# EAGLE design M104D (EAGLE 6.6.0)
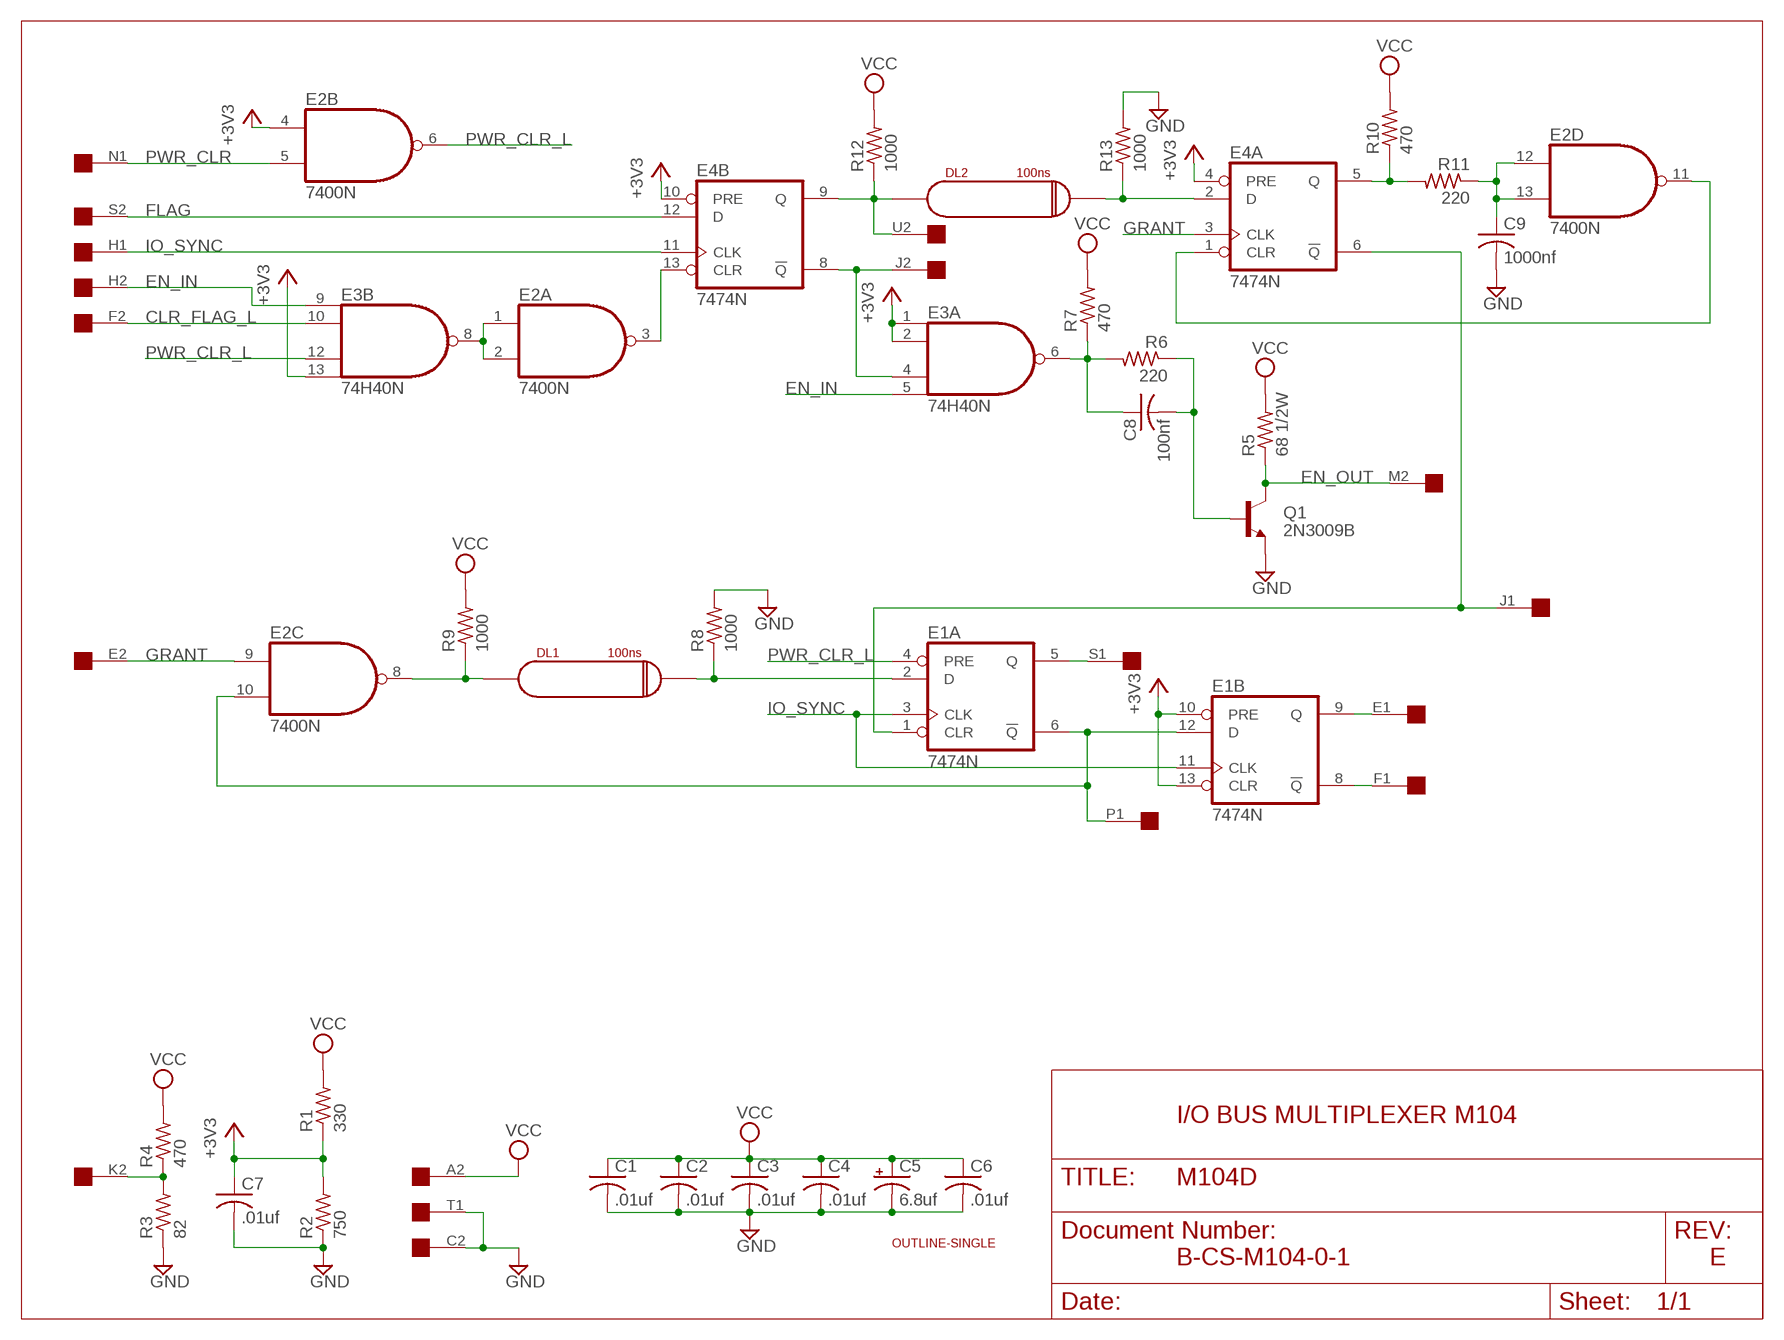
[diagram p0: schematic, sheet 1]

## Parts
C1  .01uf  C-US050-025X075  [C050-025X075]
C2  .01uf  C-US050-025X075  [C050-025X075]
C3  .01uf  C-US050-025X075  [C050-025X075]
C4  .01uf  C-US050-025X075  [C050-025X075]
C5  6.8uf  CPOL-USE15-5AXIAL  [E15-5]
C6  .01uf  C-US050-025X075  [C050-025X075]
C7  .01uf  C-US050-025X075  [C050-025X075]
C8  100nf  C-US050-025X075  [C050-025X075]
C9  1000nf  C-US050-025X075  [C050-025X075]
DL1  100ns  RC-L-22  [RCL-L-XX-22]
DL2  100ns  RC-L-22  [RCL-L-XX-22]
E1  7474N  74S74N  [DIL14]
E2  7400N  [DIL14]
E3  74H40N  74S20N  [DIL14]
E4  7474N  74S74N  [DIL14]
Q1  2N3009B  2N1613-NPN-TO39-EBC  [TO39]
R1  330  R-US_0207/10  [0207/10]
R2  750  R-US_0207/10  [0207/10]
R3  82  R-US_0207/10  [0207/10]
R4  470  R-US_0207/10  [0207/10]
R5  68 1/2W  R-US_0411/15  [0411/15]
R6  220  R-US_0207/10  [0207/10]
R7  470  R-US_0207/10  [0207/10]
R8  1000  R-US_0207/10  [0207/10]
R9  1000  R-US_0207/10  [0207/10]
R10  470  R-US_0207/10  [0207/10]
R11  220  R-US_0207/10  [0207/10]
R12  1000  R-US_0207/10  [0207/10]
R13  1000  R-US_0207/10  [0207/10]
U$8  SINGLE  [EDGE-CON2]
U$9  OUTLINE-SINGLE  [SINGLE]

## Nets
+3V3: C7.1 E1.10(B:PRE) E1.13(B:CLR) E2.4(B:I0) E3.1(A:I0) E3.2(A:I1) E3.13(B:I3) E4.4(A:PRE) E4.10(B:PRE) R1.1 R2.2
CLR_FLAG_L: E3.10(B:I1) U$8.F2
EN_IN: E3.5(A:I3) E3.9(B:I0) U$8.H2
EN_OUT: Q1.3(C) R5.1 U$8.M2
FLAG: E4.12(B:D) U$8.S2
GND [Supply]: C1.2 C2.2 C3.2 C4.2 C5.- C6.2 C7.2 C9.2 Q1.1(E) R2.1 R3.1 R8.2 R13.2 U$8.C2 U$8.T1
GRANT: E2.9(C:I0) E4.3(A:CLK) U$8.E2
IO_SYNC: E1.3(A:CLK) E1.11(B:CLK) E4.11(B:CLK) U$8.H1
K2: R3.2 R4.1 U$8.K2
N$1: E1.1(A:CLR) E4.6(A:!Q) U$8.J1
N$2: DL2.IN E4.9(B:Q) R12.1 U$8.U2
N$3: E3.4(A:I2) E4.8(B:!Q) U$8.J2
N$4: DL2.OUT E4.2(A:D) R13.1
N$5: C8.1 E3.6(A:O) R6.2 R7.1
N$6: E2.1(A:I0) E2.2(A:I1) E3.8(B:O)
N$7: E2.3(A:O) E4.13(B:CLR)
N$8: C9.1 E2.12(D:I0) E2.13(D:I1) R11.1
N$9: E2.11(D:O) E4.1(A:CLR)
N$10: DL1.IN E2.8(C:O) R9.1
N$11: DL1.OUT E1.2(A:D) R8.1
N$12: E1.6(A:!Q) E1.12(B:D) E2.10(C:I1) U$8.P1
N$13: E1.8(B:!Q) U$8.F1
N$14: E1.9(B:Q) U$8.E1
N$15: E1.5(A:Q) U$8.S1
N$16: E4.5(A:Q) R10.1 R11.2
N$17: C8.2 Q1.2(B) R6.1
PWR_CLR: E2.5(B:I1) U$8.N1
PWR_CLR_L: E1.4(A:PRE) E2.6(B:O) E3.12(B:I2)
VCC [Supply]: C1.1 C2.1 C3.1 C4.1 C5.+ C6.1 R1.2 R4.2 R5.2 R7.2 R9.2 R10.2 R12.2 U$8.A2
Unconnected: U$8.A1 U$8.B1 U$8.B2 U$8.C1 U$8.D1 U$8.D2 U$8.K1 U$8.L1 U$8.L2 U$8.M1 U$8.N2 U$8.P2 U$8.R1 U$8.R2 U$8.T2 U$8.U1 U$8.V1 U$8.V2

## Notes on the sheet
- I/O BUS MULTIPLEXER M104
- B-CS-M104-0-1 | E

## Power pins joined to a net without a drawn wire
GND: DL1.GND@1(GND) DL1.GND@2(GND) DL2.GND@1(GND) DL2.GND@2(GND) E1.7(P:GND) E2.7(P:GND) E3.7(P:GND) E4.7(P:GND)
VCC: E1.14(P:VCC) E2.14(P:VCC) E3.14(P:VCC) E4.14(P:VCC)

## Library data of the parts
C1-C4 C6-C9 = rcl:C-US: CAPACITOR, American symbol
C5 = rcl:CPOL-US: POLARIZED CAPACITOR, American symbol
DL1 DL2 = dec-con:RC-L-22: Delay Line
E1 E4 = 74xx-us:74*74: Dual D type positive edge triggered FLIP FLOP, preset and clear
E2 = 74xx-us:74*00: Quad 2-input NAND gate
E3 = 74xx-us:74*20: Dual 4-input NAND gate
Q1 = transistor:*-NPN-: NPN Transistror BF959 corrected 2008.03.06
R1-R13 = rcl:R-US_: RESISTOR, American symbol
U$8 = dec-con:SINGLE: Single-Height DEC board
U$9 = dec-con:OUTLINE-*: Board outlines for DEC boards.

## Net classes
1 Supply: width 0.813 mm

## Board
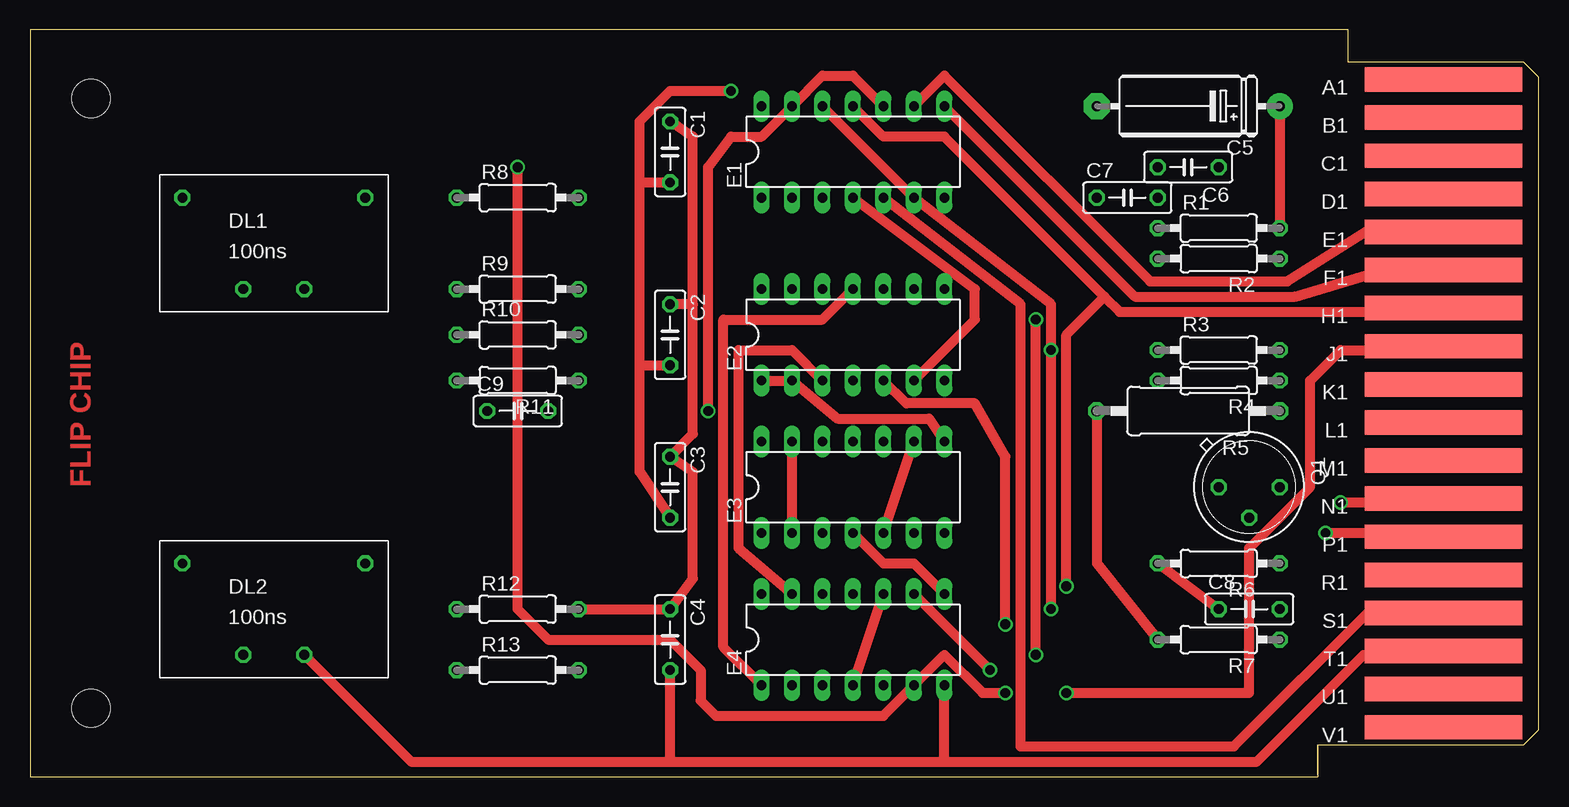
[diagram p1: board, top side]
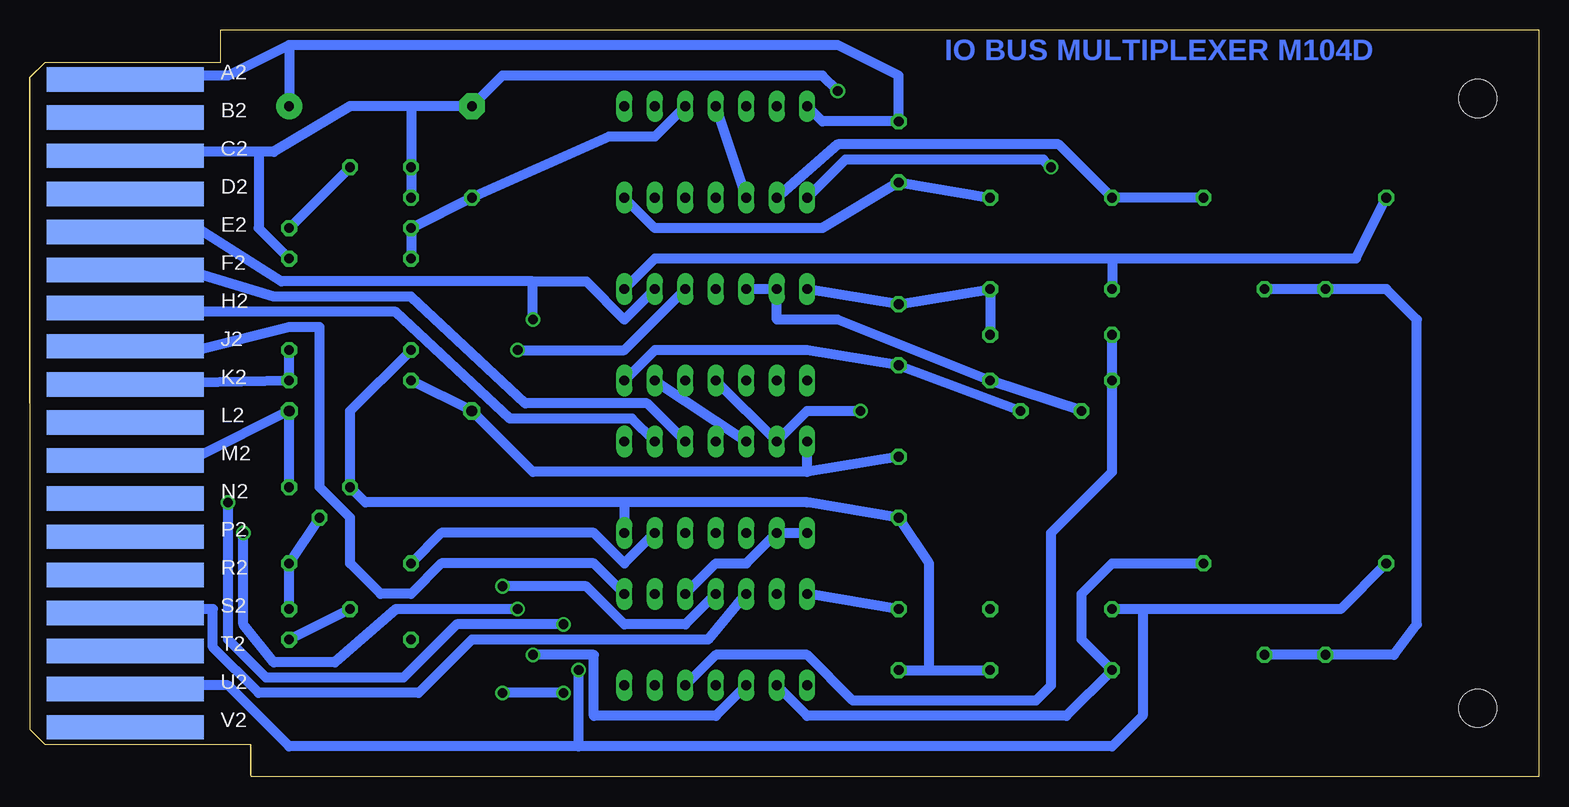
[diagram p2: board, bottom side, seen from below]

Size 125.73 x 62.23 mm. Coordinates in mm from the lower left corner, seen from the top.
Copper layers (1+16): Top 0.035mm / dielectric 1.5mm / Bottom 0.035mm
Design rules "16mils": minimum track width 16mil, minimum drill 32mil, track to track 15mil, track to pad 10mil, pad to pad 10mil, via to via 10mil, smd to smd 10mil, copper to edge 13mil, drill to drill 10mil, minimum pad ring 10mil, minimum via ring 8mil, stop-mask expansion 0mil, vias tented up to drill 0mil, thermal gap 10mil

### Footprints (pad centres in the part's own frame; a part is rotated, then mirrored left to right if it is on the bottom)
C050-025X075 = drill 0.813 octagon: 1 -2.54,0; 2 2.54,0
E15-5 = drill 0.813 pad 2.159: + -7.62,0 | drill 0.813 pad 2.159 octagon: - 7.62,0
RCL-L-XX-22 = drill 0.813 octagon: GND@1 6.35,1.27; GND@2 11.43,1.27; IN 1.27,8.89; OUT 16.51,8.89
DIL14 = drill 0.813 long: 1 -7.62,-3.81; 2 -5.08,-3.81; 3 -2.54,-3.81; 4 0,-3.81; 5 2.54,-3.81; 6 5.08,-3.81; 7 7.62,-3.81; 8 7.62,3.81; 9 5.08,3.81; 10 2.54,3.81; 11 0,3.81; 12 -2.54,3.81; 13 -5.08,3.81; 14 -7.62,3.81
TO39 = drill 0.813 octagon: 1 0,-2.54; 2 2.54,0; 3 0,2.54
0207/10 = drill 0.813 octagon: 1 -5.08,0; 2 5.08,0
0411/15 = drill 0.914 octagon: 1 -7.62,0; 2 7.62,0
EDGE-CON2 = smd 13.106 x 2.032: A1 7.938,4.128; B1 7.938,7.303; C1 7.938,10.477; D1 7.938,13.652; E1 7.938,16.828; F1 7.938,20.003; H1 7.938,23.177; J1 7.938,26.352; K1 7.938,29.527; L1 7.938,32.703; M1 7.938,35.877; N1 7.938,39.053; P1 7.938,42.227; R1 7.938,45.403; S1 7.938,48.578; T1 7.938,51.752; U1 7.938,54.928; V1 7.938,58.102 | smd 13.106 x 2.032 bottom: A2 7.938,4.128; B2 7.938,7.303; C2 7.938,10.477; D2 7.938,13.652; E2 7.938,16.828; F2 7.938,20.003; H2 7.938,23.177; J2 7.938,26.352; K2 7.938,29.527; L2 7.938,32.703; M2 7.938,35.877; N2 7.938,39.053; P2 7.938,42.227; R2 7.938,45.403; S2 7.938,48.578; T2 7.938,51.752; U2 7.938,54.928; V2 7.938,58.102
SINGLE = hole 3.175: 120.65,56.515; 120.65,5.715

### Placement (x,y rotation side)
C1  53.34,52.07 270 top
C2  53.34,36.83 270 top
C3  53.34,24.13 270 top
C4  53.34,11.43 270 top
C5  96.52,55.88 180 top
C6  96.52,50.8 180 top
C7  91.44,48.26 0 top
C8  101.6,13.97 0 top
C9  40.64,30.48 0 top
DL1  11.43,39.37 0 top
DL2  11.43,8.89 0 top
E1  68.58,52.07 0 top
E2  68.58,36.83 0 top
E3  68.58,24.13 0 top
E4  68.58,11.43 0 top
Q1  101.6,24.13 270 top
R1  99.06,45.72 0 top
R2  99.06,43.18 180 top
R3  99.06,35.56 0 top
R4  99.06,33.02 180 top
R5  96.52,30.48 180 top
R6  99.06,17.78 180 top
R7  99.06,11.43 180 top
R8  40.64,48.26 0 top
R9  40.64,40.64 0 top
R10  40.64,36.83 0 top
R11  40.64,33.02 180 top
R12  40.64,13.97 0 top
R13  40.64,8.89 0 top
U$8  125.73,62.23 180 top
U$9  125.73,62.23 180 top

### Tracks (layer width: path | path; a pad name or v marks a point on that pad's centre or on a via)
+3V3  (via drill 0.81)
  Top 0.813: E1.10 68.58,58.42 66.04,58.42 E1.13 60.96,53.34 58.42,53.34 56.52,50.8 v56.52,30.48 | E3.2 E3.13 | E4.4 E4.10
  Bottom 0.813: R2.2 R1.1 C7.1 77.47,53.34 73.66,53.34 E1.10 | E4.10 68.58,17.78 66.04,17.78 E3.2 E3.1 | E2.4 E3.13 60.96,30.48 v56.52,30.48
CLR_FLAG_L
  Bottom 0.813: U$8.F2 111.76,41.91 105.41,40.01 93.98,40.01 84.45,31.11 74.3,31.11 E3.10
EN_IN
  Top 0.813: E3.5 E3.9
  Bottom 0.813: U$8.H2 111.76,38.73 95.25,38.73 85.72,29.84 75.56,29.84 E3.9
EN_OUT
  Bottom 0.813: U$8.M2 111.76,26.67 R5.1 Q1.3
FLAG
  Bottom 0.813: U$8.S2 111.76,13.97 110.49,13.97 110.49,10.79 106.68,6.99 93.34,6.99 88.9,11.43 69.22,11.43 E4.12
GND  (via drill 0.81)
  Top 0.813: U$8.T1 111.12,10.16 102.23,1.27 76.2,1.27 | 53.34,1.27 31.75,1.27 DL2.GND@2 | 53.34,1.27 76.2,1.27 | 76.2,1.27 E4.7 | 53.34,1.27 C4.2 | 50.8,49.53 C1.2 | 50.8,49.53 50.8,54.61 53.34,57.15 v58.42,57.15 | C3.2 50.8,25.4 50.8,34.29 | 50.8,34.29 C2.2 | 50.8,34.29 50.8,49.53
  Bottom 0.813: U$8.C2 111.76,52.07 106.68,52.07 | 93.98,55.88 99.06,55.88 105.41,52.07 106.68,52.07 | 93.98,55.88 C6.2 C7.2 | 93.98,55.88 C5.- 86.36,58.42 59.69,58.42 v58.42,57.15 | C4.2 50.8,8.89 | C9.2 C2.2 60.96,35.56 73.66,35.56 E2.7 | 50.8,8.89 50.8,17.78 C3.2 60.96,22.86 76.2,22.86 | DL2.GND@2 DL2.GND@1 12.06,10.16 10.16,12.7 10.16,38.1 12.7,40.64 DL1.GND@1 DL1.GND@2 | R8.2 C1.2 59.69,45.72 73.66,45.72 E1.7 | 50.8,8.89 R13.2 | R2.1 106.68,45.72 106.68,52.07 | R3.1 99.06,30.48 Q1.1 97.79,22.86 76.2,22.86 | 76.2,22.86 E3.7
GRANT  (via drill 0.81)
  Top 0.813: v83.82,10.16 v83.82,38.1
  Bottom 0.813: U$8.E2 111.76,45.72 104.78,41.27 83.82,41.27 | 83.82,41.27 79.38,41.27 76.2,38.1 E2.9 | E4.3 68.58,5.08 78.74,5.08 78.74,10.16 v83.82,10.16 | v83.82,38.1 83.82,41.27
IO_SYNC  (via drill 0.81)
  Top 0.813: U$8.H1 111.76,38.73 90.81,38.73 89.53,40.01 | 89.53,40.01 76.2,53.34 71.12,53.34 E1.11 | v86.36,15.88 86.36,36.83 89.53,40.01
  Bottom 0.813: E1.11 E1.3 | E4.11 71.12,12.7 76.2,12.7 79.38,15.88 v86.36,15.88
K2
  Bottom 0.813: U$8.K2 R4.1 R3.2
N$1  (via drill 0.81)
  Top 0.813: v40.64,50.8 40.64,13.97 43.18,11.43 53.34,11.43 55.88,8.89 55.88,6.35 57.15,5.08 71.12,5.08 E4.6 76.2,10.16 79.38,6.99 v81.28,6.99 | U$8.J1 111.76,35.56 109.22,35.56 106.68,33.02 106.68,24.13 101.6,19.05 101.6,6.99 v86.36,6.99
  Bottom 0.813: E1.1 57.78,51.44 41.27,51.44 v40.64,50.8 | v81.28,6.99 v86.36,6.99
N$2  (via drill 0.81)
  Top 0.813: v80.01,8.89 E4.9
  Bottom 0.813: DL2.IN 16.51,13.97 33.02,13.97 | 33.02,13.97 R12.1 | 33.02,13.97 33.02,5.08 35.56,2.54 80.01,2.54 | 80.01,2.54 v80.01,8.89 | 80.01,2.54 104.14,2.54 109.22,7.62 111.76,7.62 U$8.U2
N$3
  Top 0.813: E4.8 73.66,17.78 71.12,17.78 E3.4
  Bottom 0.813: U$8.J2 111.76,35.56 104.14,37.47 101.6,37.47 101.6,24.13 99.06,21.59 99.06,17.78 96.52,15.24 93.98,15.24 91.44,17.78 78.74,17.78 E4.8
N$4
  Bottom 0.813: DL2.OUT 35.56,17.78 38.1,15.24 38.1,11.43 R13.1 39.37,5.08 60.96,5.08 E4.2
N$5
  Top 0.813: R6.2 C8.1
  Bottom 0.813: C8.1 R7.1 | R6.2 91.44,20.32 78.74,20.32 76.2,17.78 E3.6
N$6
  Top 0.813: E2.1 E2.2 67.31,29.84 74.93,29.84 E3.8
N$7
  Top 0.813: E4.13 59.05,19.05 59.05,35.56 63.5,35.56 E2.3
N$8
  Bottom 0.813: C9.1 R11.1 58.42,38.1 63.5,38.1 E2.13 E2.12
N$9
  Top 0.813: E4.1 57.78,10.79 57.78,38.1 66.04,38.1 E2.11
N$10
  Bottom 0.813: DL1.IN 15.24,43.18 35.56,43.18 | 35.56,43.18 R9.1 | 35.56,43.18 73.66,43.18 E2.8
N$11
  Bottom 0.813: DL1.OUT R8.1 40.01,52.7 58.42,52.7 E1.2
N$12  (via drill 0.81)
  Top 0.813: E1.12 E1.6 85.09,39.37 v85.09,35.56 v85.09,13.97 | U$8.P1 111.76,20.32 v107.95,20.32
  Bottom 0.813: E2.10 76.2,35.56 v85.09,35.56 | v107.95,20.32 107.95,12.7 105.41,9.53 100.33,9.53 95.25,13.97 v85.09,13.97
N$13
  Top 0.813: U$8.F1 111.76,41.91 105.41,40.01 92.08,40.01 E1.8
N$14
  Top 0.813: U$8.E1 111.76,45.72 104.78,41.27 93.34,41.27 76.2,58.42 E1.9
N$15
  Top 0.813: U$8.S1 111.76,13.97 100.33,2.54 82.55,2.54 82.55,39.37 E1.5
N$16
  Bottom 0.813: R10.1 R11.2 35.56,25.4 40.64,20.32 40.64,7.62 41.91,6.35 57.15,6.35 60.96,10.16 68.58,10.16 E4.5
N$17
  Bottom 0.813: C8.2 R6.1 Q1.2
PWR_CLR  (via drill 0.81)
  Top 0.813: U$8.N1 111.76,22.86 v109.22,22.86 | E2.5 73.03,31.11 78.74,31.11 81.28,26.67 v81.28,12.7
  Bottom 0.813: v109.22,22.86 109.22,11.43 106.05,8.26 94.61,8.26 90.17,12.7 v81.28,12.7
PWR_CLR_L
  Top 0.813: E2.6 78.74,38.1 78.74,40.64 E1.4
  Bottom 0.813: E3.12 E2.6
VCC
  Top 0.813: C5.+ R1.2 | 55.24,39.37 C2.1 | 55.24,39.37 55.24,28.57 C3.1 55.24,25.4 55.24,16.51 C4.1 R12.2 | C1.1 55.24,53.34 55.24,39.37 | R7.2 88.9,17.78 R5.2
  Bottom 0.813: U$8.A2 113.03,58.02 111.76,58.42 109.22,58.42 104.14,60.96 | 104.14,60.96 C5.+ | R1.2 C6.1 | 104.14,60.96 58.42,60.96 53.34,58.42 C1.1 59.69,54.61 E1.14 | E2.14 C2.1 R9.2 R10.2 | C3.1 60.96,25.4 | 60.96,25.4 E3.14 | C4.1 E4.14 | R4.2 R5.2 83.82,25.4 60.96,25.4

### Text on the board
Top: FLIP CHIP
Bottom: IO BUS MULTIPLEXER M104D